# Altium schematic sheet 01-MAIN.SchDoc
size A
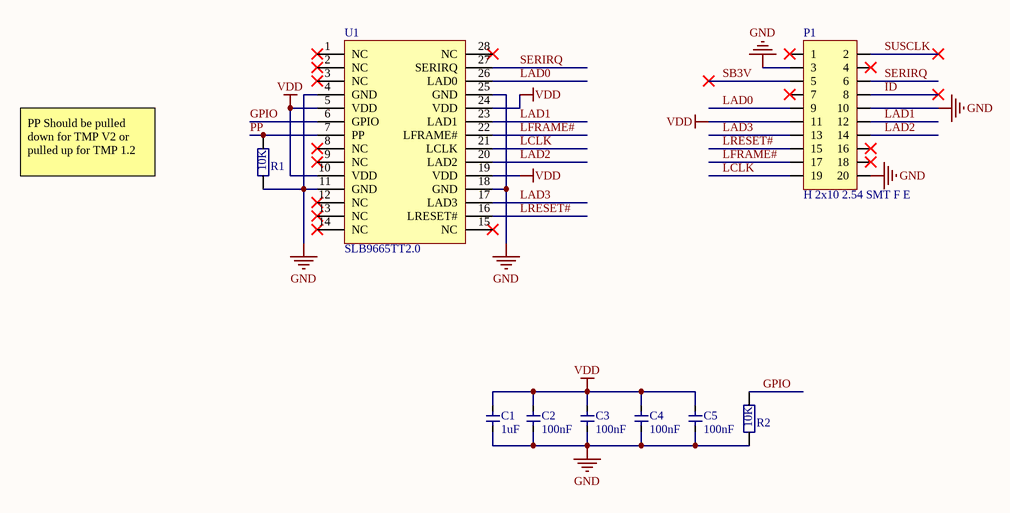
[diagram p0: 01-MAIN.SchDoc]

## Parts
C1  1uF  [C0805]
C2  100nF  [C0603_NOSILK]
C3  100nF  [C0603_NOSILK]
C4  100nF  [C0603_NOSILK]
C5  100nF  [C0603_NOSILK]
P1  H 2x10 2.54 SMT F E  [HEADER 2x10 2.54 SMT FEMALE EDGE]
R1  Resistance: 10K  [R0603_NOSILK]
R2  Resistance: 10K  [R0603_NOSILK]
U1  SLB9665TT2.0  [TSSOP-28-2]

## Nets
GND: C1.1 C2.1 C3.1 C4.1 C5.1 P1.3 P1.10 P1.20 R1.1 R2.1 U1.4(GND) U1.11(GND) U1.18(GND) U1.25(GND)
VDD: C1.2 C2.2 C3.2 C4.2 C5.2 P1.11 U1.5(VDD) U1.10(VDD) U1.19(VDD) U1.24(VDD)
GPIO: R2.2 U1.6(GPIO)
ID: P1.8
LAD0: P1.9 U1.26(LAD0)
LAD1: P1.12 U1.23(LAD1)
LAD2: P1.14 U1.20(LAD2)
LAD3: P1.13 U1.17(LAD3)
LCLK: P1.19 U1.21(LCLK)
LFRAME#: P1.17 U1.22(LFRAME#)
LRESET#: P1.15 U1.16(LRESET#)
PP: R1.2 U1.7(PP)
SB3V: P1.5
SERIRQ: P1.6 U1.27(SERIRQ)
SUSCLK: P1.2

Not connected (* = marked no-connect by the designer): P1 1* 4* 7* 16* 18*; U1 1(NC)* 2(NC)* 3(NC)* 8(NC)* 9(NC)* 12(NC)* 13(NC)* 14(NC)* 15(NC)* 28(NC)*

## Notes on the sheet
- PP Should be pulled down for TMP V2 or pulled up for TMP 1.2

## Library data of the parts
C1 = C0805_1uF_25V: Ceramic capacitor; Voltage: 25V; Capacity: 1uF; Size: 0805; PriceKosmodromUAH: 1; Kosmodrom: http://www.kosmodrom.com.ua/el.php?name=CP0805125V10; Value: 1uF
C2-C5 = C0603_100nF_16V: Ceramic capacitor; Voltage: 16V; MF: YAGEO; MP: CC0603KRX7R7BB104; Capacity: 100nF; Size: 0603; PriceKosmodromUAH: 1; Kosmodrom: http://www.kosmodrom.com.ua/el.php?name=CP06030.125V8020; LCSC: C108079; PriceLCSC: 0.0049; ComponentLink1Description: URLLCSC; ComponentLink1URL: https://lcsc.com/product-detail/Multilayer-Ceramic-Capacitors-MLCC-SMD-SMT_YAGEO-CC0603KRX7R7BB104_C108079.html; Value: 100nF
R1 R2 = R0603_10K: Resistor General; Tolerance: 5%; Owned: 3000; Size: 0603; PriceRCSUAH: 0,06; RCS: https://www.rcscomponents.kiev.ua/product/10-kohm-5-0-1w-50v-0603-rc0603jr-0710kl-yageo_107096.html
U1 = SLB9665TT2.0: TPM SLB 9665 TPM2.0 Trusted Platform Module
P1 = H 2x10 2.54 SMT F E: ComponentLink1Description: URLLCSC